# EAGLE schematic InflightController (EAGLE 9.6.1)
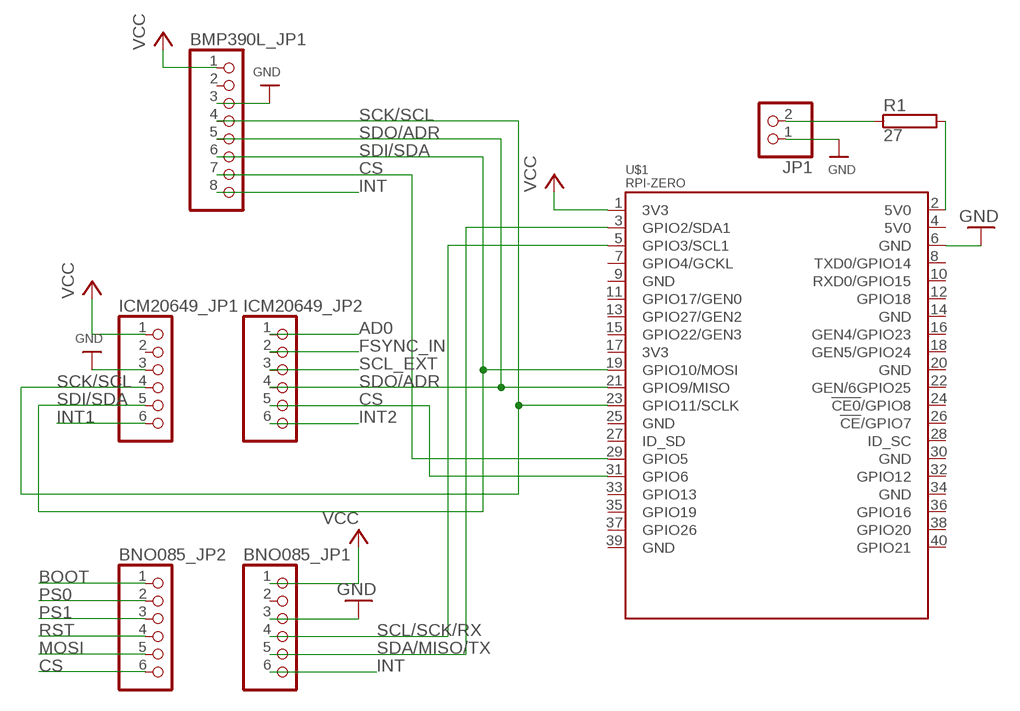
[diagram p0: schematic, sheet 1]

## Parts
BMP390L_JP1  HEADER-1X870MIL  [1X08_ROUND_70]
BNO085_JP1  HEADER-1X670MIL  [1X06_ROUND_70]
BNO085_JP2  HEADER-1X670MIL  [1X06_ROUND_70]
ICM20649_JP1  HEADER-1X670MIL  [1X06_ROUND_70]
ICM20649_JP2  HEADER-1X6ROUND  [1X06_ROUND]
JP1  PINHD-1X2  [1X02]
R1  27  RCA0001  [CA0001]
U$1  RPI-ZERO  [RASPBERRYPI_BASTELSTUBE_V13_RASPI_BOARD_B+_FULL]

## Nets
3V3@1 [lowpower]: U$1.1(3V3) ; supply symbol labelled VCC
5V0@1: R1.2 U$1.2(5V0)
AD0: ICM20649_JP2.1
BOOT: BNO085_JP2.1
CS: BMP390L_JP1.7 BNO085_JP2.6 ICM20649_JP2.5 U$1.29(GPIO5) U$1.31(GPIO6)
FSYNC_IN: ICM20649_JP2.2
GND [lowpower]: BMP390L_JP1.3 BNO085_JP1.3 ICM20649_JP1.3 JP1.1 U$1.6(GND)
INT: BMP390L_JP1.8 BNO085_JP1.6
INT1: ICM20649_JP1.6
INT2: ICM20649_JP2.6
MOSI: BNO085_JP2.5
N$1: JP1.2 R1.1
PS0: BNO085_JP2.2
PS1: BNO085_JP2.3
RST: BNO085_JP2.4
SCK/SCL: BMP390L_JP1.4 ICM20649_JP1.4 U$1.23(GPIO11/SCLK)
SCL/SCK/RX: BNO085_JP1.4 U$1.5(GPIO3/SCL1)
SCL_EXT: ICM20649_JP2.3
SDA/MISO/TX: BNO085_JP1.5 U$1.3(GPIO2/SDA1)
SDI/SDA: BMP390L_JP1.6 ICM20649_JP1.5 U$1.19(GPIO10/MOSI)
SDO/ADR: BMP390L_JP1.5 ICM20649_JP2.4 U$1.21(GPIO9/MISO)
VCC [lowpower]: BMP390L_JP1.1 BNO085_JP1.1 ICM20649_JP1.1
Unconnected: BMP390L_JP1.2 BNO085_JP1.2 ICM20649_JP1.2 U$1.4(5V0) U$1.7(GPIO4/GCKL) U$1.8(TXD0/GPIO14) U$1.9(GND) U$1.10(RXD0/GPIO15) U$1.11(GPIO17/GEN0) U$1.12(GPIO18) U$1.13(GPIO27/GEN2) U$1.14(GND) U$1.15(GPIO22/GEN3) U$1.16(GEN4/GPIO23) U$1.17(3V3) U$1.18(GEN5/GPIO24) U$1.20(GND) U$1.22(GEN/6GPIO25) U$1.24(!CE0!/GPIO8) U$1.25(GND) U$1.26(!CE!/GPIO7) U$1.27(ID_SD) U$1.28(ID_SC) U$1.30(GND) U$1.32(GPIO12) U$1.33(GPIO13) U$1.34(GND) U$1.35(GPIO19) U$1.36(GPIO16) U$1.37(GPIO26) U$1.38(GPIO20) U$1.39(GND) U$1.40(GPIO21)

## Library data of the parts
BMP390L_JP1 = microbuilder:HEADER-1X8: PIN HEADER
BNO085_JP1 BNO085_JP2 ICM20649_JP1 ICM20649_JP2 = microbuilder:HEADER-1X6: PIN HEADER
JP1 = pinhead:PINHD-1X2: PIN HEADER
R1 = resistor-power:R: Power Resitor; OC_FARNELL: unknown; OC_NEWARK: unknown
U$1 = RPI-Zero:RPI-ZERO

## Net classes
0 default: width 0.305 mm, drill 0.508 mm, clearance 0.254 mm
1 highpower: width 0.305 mm, drill 0.483 mm
2 lowpower: width 0.254 mm, drill 0.381 mm